# Altium schematic sheet Overview.SchDoc: CATS Telemetry
size A4; Author: Luca Jost; Revision: 1.0; SheetNumber: 1; SheetTotal: 7; Subtitle: Overview
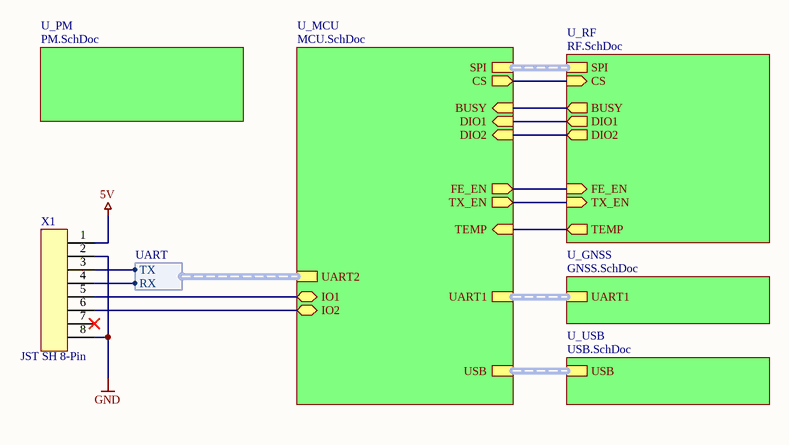
[diagram p0: Overview.SchDoc]

## Parts
X1  JST SH 8-Pin  [SMD CONNECTOR JST-SR 8 PIN]

## Sub-sheets
U_GNSS = GNSS.SchDoc: UART1 (harness UART)
U_MCU = MCU.SchDoc: SPI (harness SPI), CS (out), FE_EN (out), TX_EN (out), BUSY (in), DIO1 (in), DIO2 (in), TEMP (in), UART1 (harness UART), UART2 (harness UART), IO2 (bidir), IO1 (bidir), USB (harness USB)
U_PM = PM.SchDoc: no entries
U_RF = RF.SchDoc: SPI (harness SPI), CS (in), BUSY (out), DIO1 (out), DIO2 (out), TEMP (out), FE_EN (in), TX_EN (in)
U_USB = USB.SchDoc: USB (harness USB)

## Harnesses
UART: TX, RX

## Nets
5V: X1.1
GND: X1.2 X1.8
NetX1_3: X1.3 ; sheet U_MCU/UART2.TX
NetX1_4: X1.4 ; sheet U_MCU/UART2.RX
NetX1_5: X1.5 ; sheet U_MCU/IO1
NetX1_6: X1.6 ; sheet U_MCU/IO2
(unnamed): sheet U_MCU/CS, sheet U_RF/CS
(unnamed): sheet U_MCU/FE_EN, sheet U_RF/FE_EN
(unnamed): sheet U_MCU/TX_EN, sheet U_RF/TX_EN
(unnamed): sheet U_MCU/BUSY, sheet U_RF/BUSY
(unnamed): sheet U_MCU/DIO1, sheet U_RF/DIO1
(unnamed): sheet U_MCU/DIO2, sheet U_RF/DIO2
(unnamed): sheet U_MCU/TEMP, sheet U_RF/TEMP

Not connected (* = marked no-connect by the designer): X1 7*

## Buses and harness runs
harness sheet U_GNSS/UART1 = sheet U_MCU/UART1
harness sheet U_MCU/SPI = sheet U_RF/SPI
harness sheet U_MCU/USB = sheet U_USB/USB

## Notes on the sheet
- Title
- Author:
- Subtitle
- Date:
- Rev:
- CATS
- Sheet
- of
- File:

## Library data of the parts
X1 = JST SH 8-Pin: Crimp Style Connectors (Wire-to-Board type); Digikey: 455-1808-1-ND